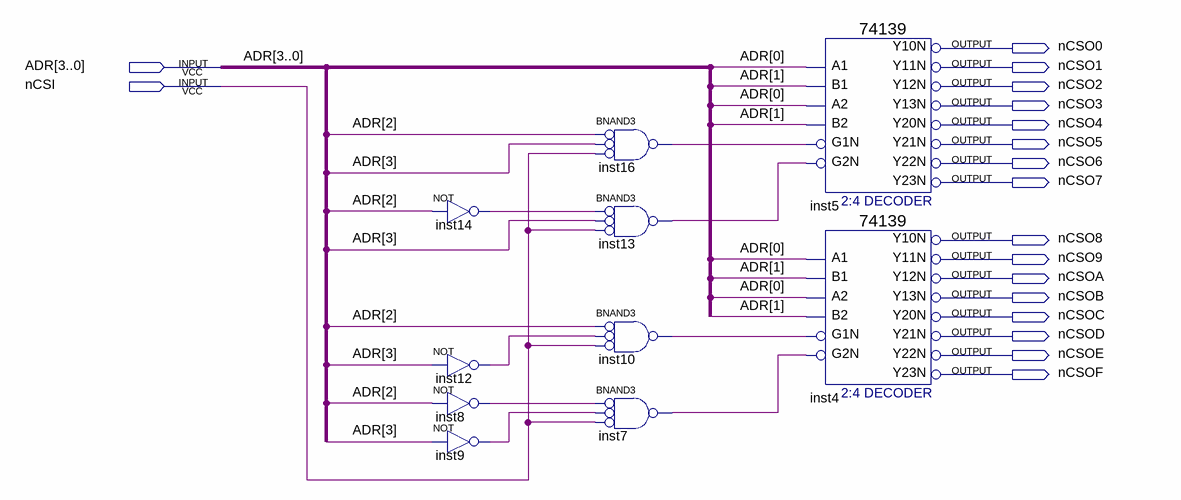
[diagram p0: schematic sheet]
// Quartus schematic Decode16.bdf as structural Verilog: 10 symbols, 18 pins
module Decode16 (
  input  [3:0] ADR,
  input  nCSI,
  output nCSO0,
  output nCSO1,
  output nCSO2,
  output nCSO3,
  output nCSO4,
  output nCSO5,
  output nCSO6,
  output nCSO7,
  output nCSO8,
  output nCSO9,
  output nCSOA,
  output nCSOB,
  output nCSOC,
  output nCSOD,
  output nCSOE,
  output nCSOF
);

  wire inst7_out, inst8_out, inst9_out, inst10_out, inst12_out, inst13_out, inst14_out, inst16_out;

  not inst14 (inst14_out, ADR[2]);
  not inst12 (inst12_out, ADR[3]);
  not inst8 (inst8_out, ADR[2]);
  not inst9 (inst9_out, ADR[3]);
  nand inst16 (inst16_out, ~ADR[2], ~ADR[3], ~nCSI);  // BNAND3
  nand inst13 (inst13_out, ~inst14_out, ~ADR[3], ~nCSI);  // BNAND3
  nand inst10 (inst10_out, ~ADR[2], ~inst12_out, ~nCSI);  // BNAND3
  nand inst7 (inst7_out, ~inst8_out, ~inst9_out, ~nCSI);  // BNAND3
  \74139  inst5 (
    .A1(ADR[0]), .A2(ADR[0]), .B1(ADR[1]), .B2(ADR[1]), .G1N(inst16_out), .G2N(inst13_out), .Y10N(nCSO0),
    .Y20N(nCSO4), .Y13N(nCSO3), .Y12N(nCSO2), .Y11N(nCSO1), .Y21N(nCSO5), .Y22N(nCSO6), .Y23N(nCSO7));
  \74139  inst4 (
    .A1(ADR[0]), .A2(ADR[0]), .B1(ADR[1]), .B2(ADR[1]), .G1N(inst10_out), .G2N(inst7_out), .Y10N(nCSO8),
    .Y20N(nCSOC), .Y13N(nCSOB), .Y12N(nCSOA), .Y11N(nCSO9), .Y21N(nCSOD), .Y22N(nCSOE), .Y23N(nCSOF));
endmodule
